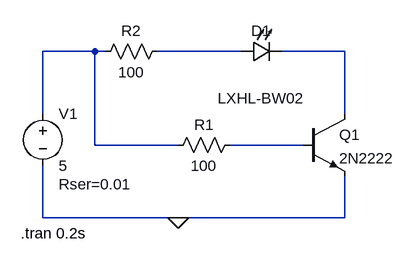
[diagram p0: schematic circuit_1.asc]
circuit_1.asc, the LTspice schematic file:
Version 4
SHEET 1 880 680
WIRE 80 144 0 144
WIRE 96 144 80 144
WIRE 304 144 176 144
WIRE 464 144 368 144
WIRE 0 240 0 144
WIRE 464 240 464 144
WIRE 80 288 80 144
WIRE 208 288 80 288
WIRE 400 288 288 288
WIRE 0 400 0 320
WIRE 208 400 0 400
WIRE 464 400 464 336
WIRE 464 400 208 400
FLAG 208 400 0
SYMBOL LED 304 128 M90
WINDOW 0 0 32 VBottom 2
WINDOW 3 72 32 VTop 2
SYMATTR InstName D1
SYMATTR Value LXHL-BW02
SYMBOL voltage 0 224 R0
WINDOW 123 0 0 Left 0
WINDOW 39 24 124 Left 2
SYMATTR InstName V1
SYMATTR Value 5
SYMATTR SpiceLine Rser=0.01
SYMBOL npn 400 240 R0
SYMATTR InstName Q1
SYMATTR Value 2N2222
SYMBOL res 304 272 R90
WINDOW 0 0 56 VBottom 2
WINDOW 3 32 56 VTop 2
SYMATTR InstName R1
SYMATTR Value 100
SYMBOL res 192 128 R90
WINDOW 0 0 56 VBottom 2
WINDOW 3 32 56 VTop 2
SYMATTR InstName R2
SYMATTR Value 100
TEXT -34 424 Left 2 !.tran 0.2s

The netlist it stands for:
* circuit_1.asc
D1 N002 N003 LXHL-BW02
V1 N001 0 5 Rser=0.01
Q1 N003 N004 0 0 2N2222
R1 N004 N001 100
R2 N002 N001 100
.model D D
.lib standard.dio
.model NPN NPN
.model PNP PNP
.lib standard.bjt
.tran 0.2s
.backanno
.end